# Altium schematic sheet NRF24L01_SPI#4.SchDoc
size A4; DocumentNumber: 2; SheetNumber: 2; SheetTotal: 2
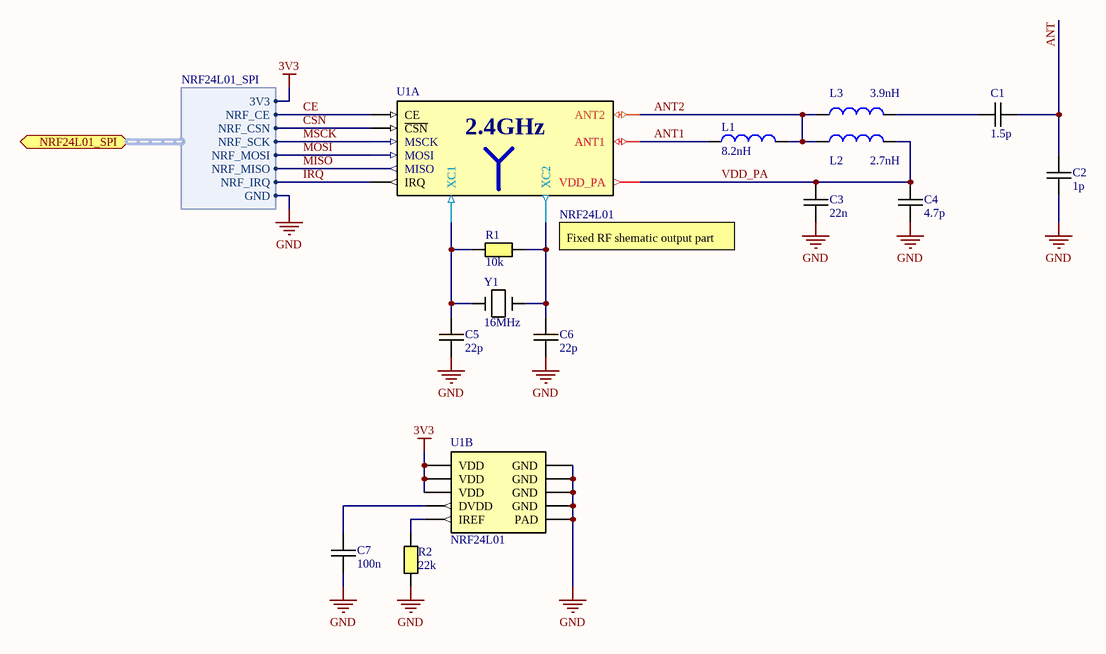
[diagram p0: NRF24L01_SPI#4.SchDoc]

## Parts
C1  1.5p  [CAPC0603(1608)55_L]
C2  1p  [CAPC0603(1608)55_L]
C3  22n  [CAPC0603(1608)55_L]
C4  4.7p  [CAPC0603(1608)55_L]
C5  22p  [CAPC0603(1608)55_L]
C6  22p  [CAPC0603(1608)55_L]
C7  100n  [CAPC0603(1608)55_L]
L1  8.2nH  [CAPC01005(0402)22_N]
L2  2.7nH  [CAPC01005(0402)22_N]
L3  3.9nH  [CAPC01005(0402)22_N]
R1  value 10k  [RESC0603(1608)_N]  (hidden comment: 1M)
R2  22k  [RESC0603(1608)_N]
U1  NRF24L01  [QFN20]  (parts A,B of 2)
Y1  16MHz  [3225]

## Ports
NRF24L01_SPI (harness NRF24L01_SPI)

## Harnesses
NRF24L01_SPI: 3V3, NRF_CE, NRF_CSN, NRF_SCK, NRF_MOSI, NRF_MISO, NRF_IRQ, GND

## Nets
3V3: U1.7(VDD) U1.15(VDD) U1.18(VDD) ; port NRF24L01_SPI.3V3
GND: C2.1 C3.2 C4.2 C5.2 C6.2 C7.2 R2.2 U1.8(GND) U1.14(GND) U1.17(GND) U1.20(GND) U1.21(PAD) Y1.2 Y1.4 ; port NRF24L01_SPI.GND
ANT: C1.2 C2.2
ANT1: L1.1 U1.12(ANT1)
ANT2: L1.2 L2.1 L3.1 U1.13(ANT2)
CE: U1.1(CE) ; port NRF24L01_SPI.NRF_CE
CSN: U1.2(~{CSN}) ; port NRF24L01_SPI.NRF_CSN
IRQ: U1.6(IRQ) ; port NRF24L01_SPI.NRF_IRQ
MISO: U1.5(MISO) ; port NRF24L01_SPI.NRF_MISO
MOSI: U1.4(MOSI) ; port NRF24L01_SPI.NRF_MOSI
MSCK: U1.3(MSCK) ; port NRF24L01_SPI.NRF_SCK
VDD_PA: C3.1 C4.1 L2.2 U1.11(VDD_PA)
NetC1_1: C1.1 L3.2
NetC5_1: C5.1 R1.1 U1.10(XC1) Y1.1
NetC6_1: C6.1 R1.2 U1.9(XC2) Y1.3
NetC7_1: C7.1 U1.19(DVDD)
NetR2_1: R2.1 U1.16(IREF)

## Notes on the sheet
- (near U1) Fixed RF shematic output part
- (in symbol NRF24L01, part A) 2.4GHz

## Library data of the parts
C1-C7 = Capacitor H: Ceramic capacitor High density
  C1: Value: 1.5p
  C2: Value: 1p
  C3: Value: 22n
  C4: Value: 4.7p
  C5 C6: Value: 22p
  C7: Value: 100n
L1-L3 = Inductor
  L1: Value: 8.2nH
  L2: Value: 2.7nH
  L3: Value: 3.9nH
R1 R2 = Resistor M: Resistor Medium Density
  R2: Value: 22k
U1 = NRF24L01: 2.4GHz WIRELESS TRANSIVER
Y1 = CRYSTAL: Value: 16MHz